# Altium schematic sheet rs485.SchDoc
size A
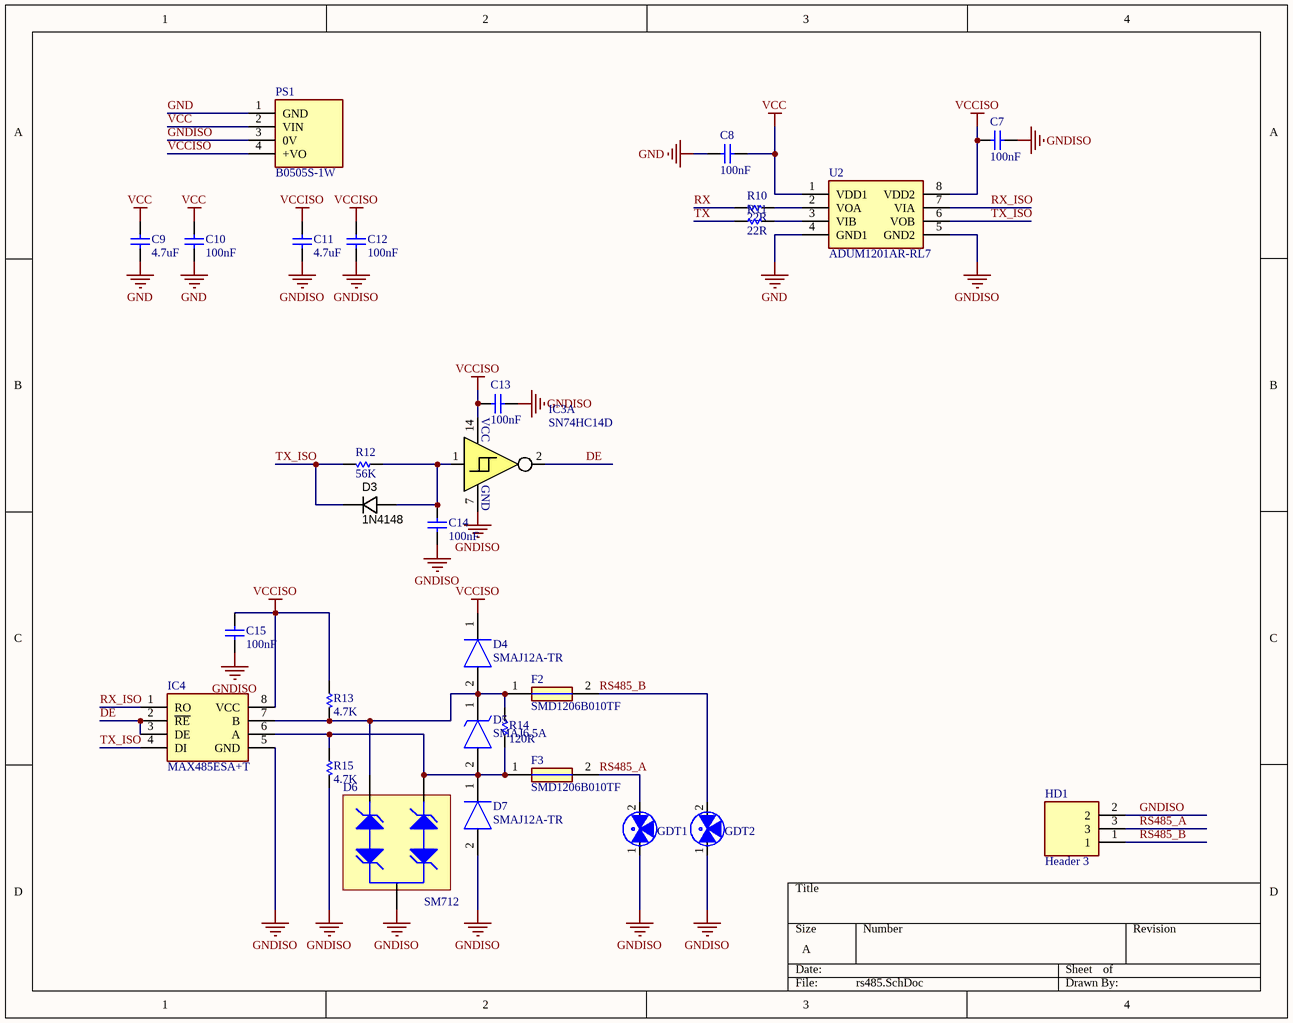
[diagram p0: rs485.SchDoc]

## Parts
C7  100nF  [CAP-0603-Standard]
C8  100nF  [CAP-0603-Standard]
C9  4.7uF  [CAP-0603-Standard]
C10  100nF  [CAP-0603-Standard]
C11  4.7uF  [CAP-0603-Standard]
C12  100nF  [CAP-0603-Standard]
C13  100nF  [CAP-0603-Standard]
C14  100nF  [CAP-0603-Standard]
C15  100nF  [CAP-0603-Standard]
D3  1N4148  [SOD523F]
D4  SMAJ12A-TR  [DIOM5126X265N]
D5  SMAJ6.5A  [DIOM5026X229N]
D6  SM712  [SOT23]
D7  SMAJ12A-TR  [DIOM5126X265N]
F2  SMD1206B010TF  [FUSC3216X100N]
F3  SMD1206B010TF  [FUSC3216X100N]
GDT1  2RL150M-5  [2R-5-ST5]  (value not drawn)
GDT2  2RL150M-5  [2R-5-ST5]  (value not drawn)
HD1  Header 3  [SHDRRA3W80P0X381_1X3_1190X920X720P]
IC3  SN74HC14D  [SOIC127P600X175-14N]  (part A of 6)
IC4  MAX485ESA+T  [SOIC127P600X175-8N]
PS1  B0505S-1W  [B0505S1W]
R10  22R  [RES-0603-STANDARD]
R11  22R  [RES-0603-STANDARD]
R12  56K  [RES-0603-STANDARD]
R13  4.7K  [RES-0603-STANDARD]
R14  120R  [RES-0603-STANDARD]
R15  4.7K  [RES-0603-STANDARD]
U2  ADUM1201AR-RL7  [SOIC127P600X175-8N]

## Nets
GND: C8.2 C9.2 C10.2 PS1.1(GND) U2.4(GND1)
GNDISO: C7.1 C11.2 C12.2 C13.1 C14.2 C15.1 D6.3 D7.2(A) GDT1.1 GDT2.1 HD1.2 IC3.7(GND) IC4.5(GND) PS1.3(0V) R15.2 U2.5(GND2)
VCC: C8.1 C9.1 C10.1 PS1.2(VIN) U2.1(VDD1)
VCCISO: C7.2 C11.1 C12.1 C13.2 C15.2 D4.1(K) IC3.14(VCC) IC4.8(VCC) PS1.4(+VO) R13.1 U2.8(VDD2)
DE: IC3.2(1Y) IC4.2(~{RE}) IC4.3(DE)
RS485_A: F3.2 GDT1.2 HD1.3
RS485_B: F2.2 GDT2.2 HD1.1
RX: R10.1
RX_ISO: IC4.1(RO) U2.7(VIA)
TX: R11.1
TX_ISO: D3.K IC4.4(DI) R12.2 U2.6(VOB)
NetC14_1: C14.1 D3.A IC3.1(1A) R12.1
NetD4_2: D4.2(A) D5.1(K) D6.2 F2.1 IC4.7(B) R13.2 R14.1
NetD5_2: D5.2(A) D6.1 D7.1(K) F3.1 IC4.6(A) R14.2 R15.1
NetR10_2: R10.2 U2.2(VOA)
NetR11_2: R11.2 U2.3(VIB)

## Library data of the parts
C7 C8 C10 C12-C15 = CAP-0603-0.1uF: CAP-CER, SMD, 0603, 0.1UF; Manufacturer: AVX; Manufacturer Part Number: 06031C104JAT2A; Tolerance: ±5%; Voltage - Rated: 100V; Operating Temperature: -55°C ~ 125°C; Package / Case: 0603 (1608 Metric); Distributor: Mouser; Price: 0.66; Capacitance: 100nF
C9 C11 = CAP-0603-0.1uF: CAP-CER, SMD, 0603, 4.7UF, 5%, 100V; Manufacturer: AVX; Manufacturer Part Number: 06031C104JAT2A; Tolerance: ±5%; Operating Temperature: -55°C ~ 125°C; Package / Case: 0603 (1608 Metric); Voltage - Rated: 100V; Distributor: Mouser; Price: 0.66; Capacitance: 4.7uF
D3 = DIODE_1N4148_200mA_SOD523F: Diode SMD small signal 0.2A SOD-523F; Ratings: Vr=75V; Vf=1V@10mA; Io=200mA; Material: Si; Package / Case: SC-79, SOD-523F; Supplier 1: Digi-Key; Supplier Part Number 1: 1N4148WTCT-ND; Value: 1N4148
D4 D7 = SMAJ12A-TR: Diode; Manufacturer_Name: STMicroelectronics; Datasheet Link: http://www.st.com/web/en/resource/technical/document/datasheet/CD00001333.pdf; Height: 2.65mm; Manufacturer_Part_Number: SMAJ12A-TR; Arrow Part Number: SMAJ12A-TR; Arrow Price/Stock: https://www.arrow.com/en/products/smaj12a-tr/stmicroelectronics; Mouser Part Number: 511-SMAJ12A-TR; Mouser Price/Stock: https://www.mouser.co.uk/ProductDetail/STMicroelectronics/SMAJ12A-TR?qs=WkDnCMkPR9d1rwo9apkNUw%3D%3D
D5 = SMAJ6.5A: TVS Diode (Uni-directional); Manufacturer_Name: LITTELFUSE; Datasheet Link: https://4donline.ihs.com/images/VipMasterIC/IC/LFSI/LFSI-S-A0001360630/LFSI-S-A0001360630-1.pdf?hkey=52A5661711E402568146F3353EA87419; Height: 2.29mm; Manufacturer_Part_Number: SMAJ6.5A; Arrow Part Number: SMAJ6.5A; Arrow Price/Stock: https://www.arrow.com/en/products/smaj6.5a/littelfuse; Mouser Part Number: 576-SMAJ6.5A; Mouser Price/Stock: https://www.mouser.co.uk/ProductDetail/Littelfuse/SMAJ65A?qs=zHiv0nsVGmpL0b0CmH5SeA%3D%3D
D6 = CDSOT23-SM712: TVS DIODE 7VWM/12VWM SOT23; Manufacturer: Bourns Inc.; Type: Zener; Voltage - Reverse Standoff (Typ): 7V (Max), 12V (Max); Voltage - Breakdown (Min): 7.5V, 13.3V; Voltage - Clamping (Max) @ Ipp: 14V, 26V; Current - Peak Pulse (10/1000µs): 17A (8/20µs); Power - Peak Pulse: 400W; Power Line Protection: No; Capacitance @ Frequency: 75pF @ 1MHz; Supplier 1: Digi-Key; Manufacturer Part Number: CDSOT23-SM712; RoHS: RoHS Compliant; Category: Circuit Protection; Stock 1: 74145; Pricing 1: 1=1.62, 10=1.437, 25=1.298, 100=1.1356, 250=0.99652, 500=0.88066, 1000=0.69525 (USD); Packaging: Cut Tape (CT); Part Status: Active; Applications: RS-485; Operating Temperature: -55°C ~ 150°C (TJ); Mounting Type: Surface Mount; Package / Case: TO-236-3, SC-59, SOT-23-3; Supplier Device Package: SOT-23-3; ComponentLink1URL: http://www.bourns.com/docs/Product-Datasheets/CDSOT23-SM712.pdf; ComponentLink1Description: http://www.bourns.com/docs/Product-Datasheets/CDSOT23-SM712.pdf; Supplier Part Number 1: CDSOT23-SM712CT-ND
F2 F3 = 1206L020YR: Fuse; Manufacturer_Name: LITTELFUSE; Datasheet Link: https://m.littelfuse.com/~/media/electronics/datasheets/resettable_ptcs/littelfuse_ptc_1206l_datasheet.pdf.pdf; Height: 1mm; Manufacturer_Part_Number: 1206L020YR; Arrow Part Number: 1206L020YR; Arrow Price/Stock: https://www.arrow.com/en/products/1206l020yr/littelfuse; Mouser Part Number: 576-1206L020YR; Mouser Price/Stock: https://www.mouser.com/Search/Refine.aspx?Keyword=576-1206L020YR
GDT1 GDT2 = 2RL150M-5: GDT 150V 5KA 2 POLE SMD
HD1 = Header 3: Terminal Block Header, 3, 300 V, 12 A, 3.81 mm; Manufacturer_Name: Amphenol; Manufacturer_Part_Number: 20020110-D031A01LF; Datasheet Link: http://uk.rs-online.com/web/p/products/7075216; Height: 7.2mm; Arrow Part Number: 20020110-D031A01LF; Arrow Price/Stock: https://www.arrow.com/en/products/20020110-d031a01lf/amphenol
IC3 = SN74HC14D_1: Hex Schmitt Trigger
IC4 = MAX485ESA+T: Integrated Circuit; Manufacturer_Name: Maxim Integrated; Datasheet Link: https://datasheets.maximintegrated.com/en/ds/MAX1487-MAX491.pdf; Height: 1.75mm; Manufacturer_Part_Number: MAX485ESA+T; Arrow Part Number: MAX485ESA+T; Mouser Part Number: 700-MAX485ESAT; Mouser Price/Stock: https://www.mouser.co.uk/ProductDetail/Maxim-Integrated/MAX485ESA%2bT?qs=LHmEVA8xxfYXmvxEk%252BFtEg%3D%3D
PS1 = B0505S-1W: Power Supply; Manufacturer_Name: Mornsun; Datasheet Link: https://www.mornsun-power.com/uploads/pdf/B_D-1W.pdf; Height: 10.41mm; Manufacturer_Part_Number: B0505S-1W; Arrow Part Number: B0505S-1W
R10 R11 R13 R15 = RES-0603: RES, SMD, 0603, 5%, 1/10W, THICK FILM; Manufacturer: Yageo; Manufacturer Part Number: AC0603FR-101KL; Tolerance: 1%; Power (Watts): 0.1W, 1/10W; Operating Temperature: -55°C ~ 155°C; Package / Case: 0603 (1608 Metric); Price: 0.1; Distributor: Mouser
  R10 R11: Resistance: 22R
  R13 R15: Resistance: 4.7K
R12 R14 = RES-0603: RES, SMD, 0603, 1%, 1/10W, THICK FILM; Manufacturer: Yageo; Manufacturer Part Number: AC0603FR-101KL; Power (Watts): 0.1W, 1/10W; Operating Temperature: -55°C ~ 155°C; Package / Case: 0603 (1608 Metric); Price: 0.1; Distributor: Mouser; Tolerance: 1%
  R12: Resistance: 56K
  R14: Resistance: 120R
U2 = ADUM1201AR-RL7: Capacitor; Manufacturer_Name: Analog Devices; Datasheet Link: http://www.analog.com/media/en/technical-documentation/data-sheets/ADuM1200_1201.pdf; Height: 1.75mm; Manufacturer_Part_Number: ADUM1201AR-RL7; Arrow Part Number: ADUM1201AR-RL7; Arrow Price/Stock: https://www.arrow.com/en/products/adum1201ar-rl7/analog-devices; Mouser Part Number: 584-ADUM1201AR-R7; Mouser Price/Stock: https://www.mouser.co.uk/ProductDetail/Analog-Devices/ADUM1201AR-RL7?qs=WIvQP4zGangOW4BQdeJ35g%3D%3D